# Altium schematic sheet ModuleInter.SchDoc
size 431 x 279 mm; SheetNumber: 1; SheetTotal: 2
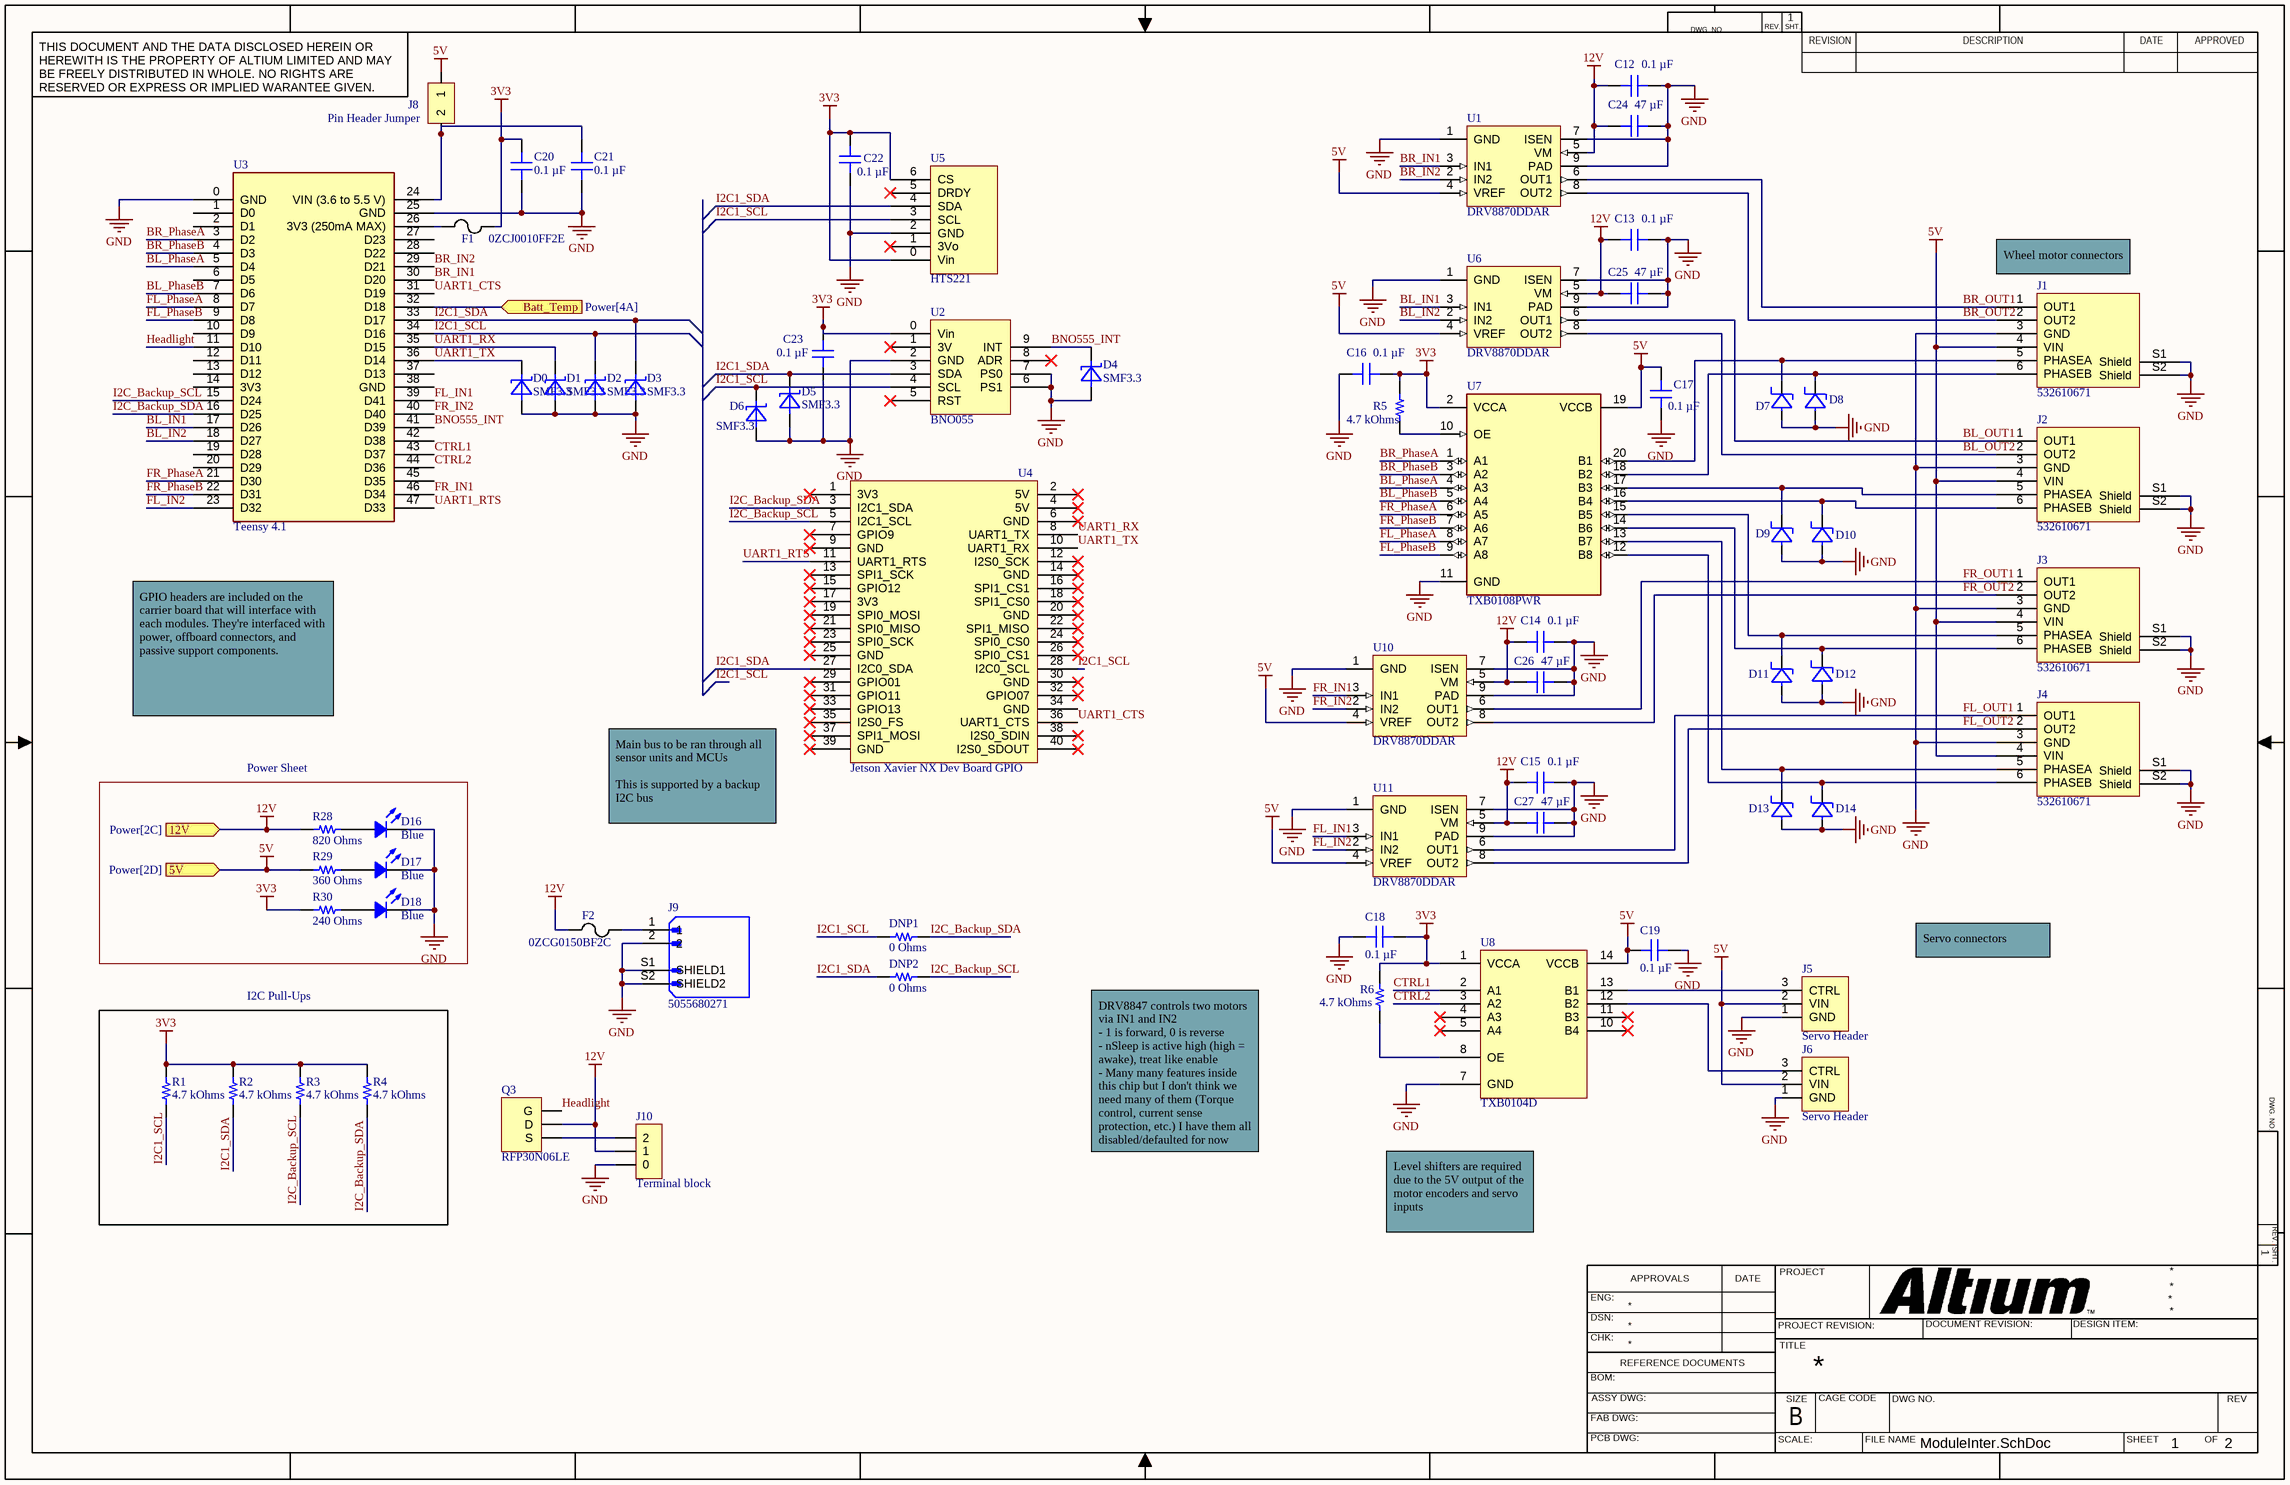
[diagram p0: ModuleInter.SchDoc]

## Parts
C12  0.1 µF  [CAP 1206_3216 - 0.8MM]
C13  0.1 µF  [CAP 1206_3216 - 0.8MM]
C14  0.1 µF  [CAP 1206_3216 - 0.8MM]
C15  0.1 µF  [CAP 1206_3216 - 0.8MM]
C16  0.1 µF  [CAP 1206_3216 - 0.8MM]
C17  0.1 µF  [CAP 1206_3216 - 0.8MM]
C18  0.1 µF  [CAP 1206_3216 - 0.8MM]
C19  0.1 µF  [CAP 1206_3216 - 0.8MM]
C20  0.1 µF  [CAP 1206_3216 - 0.8MM]
C21  0.1 µF  [CAP 1206_3216 - 0.8MM]
C22  0.1 µF  [CAP 1206_3216 - 0.8MM]
C23  0.1 µF  [CAP 1206_3216 - 0.8MM]
C24  47 µF  [CAP 1206_3216 - 0.8MM]
C25  47 µF  [CAP 1206_3216 - 0.8MM]
C26  47 µF  [CAP 1206_3216 - 0.8MM]
C27  47 µF  [CAP 1206_3216 - 0.8MM]
D0  SMF3.3  [SODFL3718X108N]
D1  SMF3.3  [SODFL3718X108N]
D2  SMF3.3  [SODFL3718X108N]
D3  SMF3.3  [SODFL3718X108N]
D4  SMF3.3  [SODFL3718X108N]
D5  SMF3.3  [SODFL3718X108N]
D6  SMF3.3  [SODFL3718X108N]
D7  SMBJ5.0CA-13-F  [SMB_DIO]  (value not drawn)
D8  SMBJ5.0CA-13-F  [SMB_DIO]  (value not drawn)
D9  SMBJ5.0CA-13-F  [SMB_DIO]  (value not drawn)
D10  SMBJ5.0CA-13-F  [SMB_DIO]  (value not drawn)
D11  SMBJ5.0CA-13-F  [SMB_DIO]  (value not drawn)
D12  SMBJ5.0CA-13-F  [SMB_DIO]  (value not drawn)
D13  SMBJ5.0CA-13-F  [SMB_DIO]  (value not drawn)
D14  SMBJ5.0CA-13-F  [SMB_DIO]  (value not drawn)
D16  Blue  [LED 1206_3216 BLUE]
D17  Blue  [LED 1206_3216 BLUE]
D18  Blue  [LED 1206_3216 BLUE]
DNP1  0 Ohms  [RES 1206_3216]
DNP2  0 Ohms  [RES 1206_3216]
F1  0ZCJ0010FF2E  [RESC3216X125N]
F2  0ZCG0150BF2C  [0ZCG_BEL]
J1  532610671  [MOLEX_532610671]
J2  532610671  [MOLEX_532610671]
J3  532610671  [MOLEX_532610671]
J4  532610671  [MOLEX_532610671]
J5  Servo Header  [Servo Header]
J6  Servo Header  [Servo Header]
J8  Pin Header Jumper  [Pin Header Jumper]
J9  5055680271  [MOLEX_5055680271]
J10  Terminal block  [Terminal Holes]
Q3  RFP30N06LE  [PWM Fet]
R1  4.7 kOhms  [RES 1206_3216]
R2  4.7 kOhms  [RES 1206_3216]
R3  4.7 kOhms  [RES 1206_3216]
R4  4.7 kOhms  [RES 1206_3216]
R5  4.7 kOhms  [RES 1206_3216]
R6  4.7 kOhms  [RES 1206_3216]
R28  820 Ohms  [RES 1206_3216]
R29  360 Ohms  [RES 1206_3216]
R30  240 Ohms  [RES 1206_3216]
U1  DRV8870DDAR  [VREG_LM5017MR/NOPB]
U2  BNO055  [BNO555 - Header Mode]
U3  Teensy 4.1  [Teensy 4.1]
U4  Jetson Xavier NX Dev Board GPIO  [Xavier Interface]
U5  HTS221  [HTS221]
U6  DRV8870DDAR  [VREG_LM5017MR/NOPB]
U7  TXB0108PWR  [SOP65P640X120-20N]
U8  TXB0104D  [TI SOIC-14 D]
U10  DRV8870DDAR  [VREG_LM5017MR/NOPB]
U11  DRV8870DDAR  [VREG_LM5017MR/NOPB]

## Blocks framed on the sheet
Power Sheet: D16-D18 R28-R30
I2C Pull-Ups: R1-R4

## Ports
5V (in, see Power[2D]), 12V (in, see Power[2C]), Batt_Temp (in, see Power[4A])

## Nets
3V3: C16.1 C18.1 C20.1 C22.1 C23.1 F1.2 R1.2 R2.2 R3.2 R4.2 R5.1 R6.2 R30.1 U2.0(Vin) U5.0(Vin) U5.6(CS) U7.2(VCCA) U8.1(VCCA)
5V: C17.1 C19.1 J1.4(VIN) J2.4(VIN) J3.4(VIN) J4.4(VIN) J5.2(VIN) J6.2(VIN) J8.1 R29.1 U1.4(VREF) U6.4(VREF) U7.19(VCCB) U8.14(VCCB) U10.4(VREF) U11.4(VREF) ; port 5V
12V: C12.2 C13.2 C14.2 C15.2 C24.1 C25.1 C26.1 C27.1 F2.1 J10.1 Q3.1(D) R28.1 U1.5(VM) U6.5(VM) U10.5(VM) U11.5(VM) ; port 12V
GND: C12.1 C13.1 C14.1 C15.1 C16.2 C17.2 C18.2 C19.2 C20.2 C21.2 C22.2 C23.2 C24.2 C25.2 C26.2 C27.2 D0.C(A) D1.C(A) D2.C(A) D3.C(A) D4.C(A) D5.C(A) D6.C(A) D7.2 D8.2 D9.2 D10.2 D11.2 D12.2 D13.2 D14.2 D16.2 D17.2 D18.2 J1.3(GND) J1.S1(Shield) J1.S2(Shield) J2.3(GND) J2.S1(Shield) J2.S2(Shield) J3.3(GND) J3.S1(Shield) J3.S2(Shield) J4.3(GND) J4.S1(Shield) J4.S2(Shield) J5.1(GND) J6.1(GND) J9.2 J9.S1(SHIELD1) J9.S2(SHIELD2) J10.0 U1.1(GND) U1.7(ISEN) U1.9(PAD) U2.2(GND) U2.6(PS1) U2.7(PS0) U3.0(GND) U3.25(GND) U5.2(GND) U6.1(GND) U6.7(ISEN) U6.9(PAD) U7.11(GND) U8.7(GND) U10.1(GND) U10.7(ISEN) U10.9(PAD) U11.1(GND) U11.7(ISEN) U11.9(PAD)
Batt_Temp: U3.32(D18) ; port Batt_Temp
BL_IN1: U3.17(D26) U6.3(IN1)
BL_IN2: U3.18(D27) U6.2(IN2)
BL_OUT1: J2.1(OUT1) U6.6(OUT1)
BL_OUT2: J2.2(OUT2) U6.8(OUT2)
BL_PhaseA: U3.5(D4) U7.4(A3)
BL_PhaseB: U3.7(D6) U7.5(A4)
BNO555_INT: D4.A(C) U2.9(INT) U3.41(D39)
BR_IN1: U1.3(IN1) U3.30(D20)
BR_IN2: U1.2(IN2) U3.29(D21)
BR_OUT1: J1.1(OUT1) U1.6(OUT1)
BR_OUT2: J1.2(OUT2) U1.8(OUT2)
BR_PhaseA: U3.3(D2) U7.1(A1)
BR_PhaseB: U3.4(D3) U7.3(A2)
CTRL1: U3.43(D37) U8.2(A1)
CTRL2: U3.44(D36) U8.3(A2)
FL_IN1: U3.39(D41) U11.3(IN1)
FL_IN2: U3.23(D32) U11.2(IN2)
FL_OUT1: J4.1(OUT1) U11.6(OUT1)
FL_OUT2: J4.2(OUT2) U11.8(OUT2)
FL_PhaseA: U3.8(D7) U7.8(A7)
FL_PhaseB: U3.9(D8) U7.9(A8)
FR_IN1: U3.46(D34) U10.3(IN1)
FR_IN2: U3.40(D40) U10.2(IN2)
FR_OUT1: J3.1(OUT1) U10.6(OUT1)
FR_OUT2: J3.2(OUT2) U10.8(OUT2)
FR_PhaseA: U3.21(D30) U7.6(A5)
FR_PhaseB: U3.22(D31) U7.7(A6)
Headlight: Q3.0(G) U3.11(D10)
I2C1_SCL: D2.A(C) D6.A(C) DNP1.1 R1.1 U2.4(SCL) U3.34(D16) U4.28(I2C0_SCL) U5.3(SCL)
I2C1_SDA: D3.A(C) D5.A(C) DNP2.1 R2.1 U2.3(SDA) U3.33(D17) U4.27(I2C0_SDA) U5.4(SDA)
I2C_Backup_SCL: DNP2.2 R3.1 U3.15(D24) U4.5(I2C1_SCL)
I2C_Backup_SDA: DNP1.2 R4.1 U3.16(D25) U4.3(I2C1_SDA)
UART1_CTS: U3.31(D19) U4.36(UART1_CTS)
UART1_RTS: U3.47(D33) U4.11(UART1_RTS)
UART1_RX: D1.A(C) U3.35(D15) U4.8(UART1_TX)
UART1_TX: D0.A(C) U3.36(D14) U4.10(UART1_RX)
NetC21_1: C21.1 J8.2 U3.24(VIN_(3.6_to_5.5_V))
NetD7_1: D7.1 J1.5(PHASEA) U7.20(B1)
NetD8_1: D8.1 J1.6(PHASEB) U7.18(B2)
NetD9_1: D9.1 J2.5(PHASEA) U7.17(B3)
NetD10_1: D10.1 J2.6(PHASEB) U7.16(B4)
NetD11_1: D11.1 J3.5(PHASEA) U7.15(B5)
NetD12_1: D12.1 J3.6(PHASEB) U7.14(B6)
NetD13_1: D13.1 J4.5(PHASEA) U7.13(B7)
NetD14_1: D14.1 J4.6(PHASEB) U7.12(B8)
NetD16_1: D16.1 R28.2
NetD17_1: D17.1 R29.2
NetD18_1: D18.1 R30.2
NetF1_1: F1.1 U3.26(3V3_(250mA_MAX))
NetF2_2: F2.2 J9.1
NetJ5_3: J5.3(CTRL) U8.13(B1)
NetJ6_3: J6.3(CTRL) U8.12(B2)
NetJ10_2: J10.2 Q3.2(S)
NetR5_2: R5.2 U7.10(OE)
NetR6_1: R6.1 U8.8(OE)

Not connected (* = marked no-connect by the designer): U2 1(3V)* 5(RST)* 8(ADR)*; U3 1(D0) 2(D1) 6(D5) 10(D9) 12(D11) 13(D12) 14(3V3) 19(D28) 20(D29) 27(D23) 28(D22) 37(D13) 38(GND) 42(D38) 45(D35); U4 1(3V3)* 2(5V)* 4(5V)* 6(GND)* 7(GPIO9)* 9(GND)* 12(I2S0_SCK)* 13(SPI1_SCK)* 14(GND)* 15(GPIO12)* 16(SPI1_CS1)* 17(3V3)* 18(SPI1_CS0)* 19(SPI0_MOSI)* 20(GND)* 21(SPI0_MISO)* 22(SPI1_MISO)* 23(SPI0_SCK)* 24(SPI0_CS0)* 25(GND)* 26(SPI0_CS1)* 29(GPIO01)* 30(GND)* 31(GPIO11)* 32(GPIO07)* 33(GPIO13)* 34(GND) 35(I2S0_FS)* 37(SPI1_MOSI)* 38(I2S0_SDIN)* 39(GND)* 40(I2S0_SDOUT)*; U5 1(3Vo)* 5(DRDY)*; U8 4(A3)* 5(A4)* 10(B4)* 11(B3)*

## Notes on the sheet
- (near J1) Wheel motor connectors
- GPIO headers are included on the carrier board that will interface with each modules. They're interfaced with power, offboard connectors, and passive support components.
- Main bus to be ran through all sensor units and MCUs
  This is supported by a backup I2C bus
- Servo connectors
- DRV8847 controls two motors via IN1 and IN2
  - 1 is forward, 0 is reverse
  - nSleep is active high (high = awake), treat like enable
  - Many many features inside this chip but I don't think we need many of them (Torque control, current sense protection, etc.) I have them all disabled/defaulted for now
- Level shifters are required due to the 5V output of the motor encoders and servo inputs
- DWG. NO.
- REV.
- SHT.
- THIS DOCUMENT AND THE DATA DISCLOSED HEREIN OR HEREWITH IS THE PROPERTY OF ALTIUM LIMITED AND MAY BE FREELY DISTRIBUTED IN WHOLE. NO RIGHTS ARE RESERVED OR EXPRESS OR IMPLIED WARANTEE GIVEN.
- REVISION
- DESCRIPTION
- DATE
- APPROVED
- ENG:
- APPROVALS
- PROJECT
- DSN:
- CHK:
- REFERENCE DOCUMENTS
- PROJECT REVISION:
- TITLE
- DOCUMENT REVISION:
- DESIGN ITEM:
- BOM:
- FAB DWG:
- PCB DWG:
- ASSY DWG:
- SCALE:
- SIZE
- B
- CAGE CODE
- FILE NAME
- DWG NO.
- SHEET
- OF
- REV

## Library data of the parts
C12-C23 = CC1206MRY5V9BB104: CAP CER 0.1UF 50V Y5V 1206; manufacturer: Yageo; Temperature Coefficient: Y5V (F); Tolerance: ±20%; Part Number: CC1206MRY5V9BB104; Value: 0.1 µF; Applications: General Purpose; Capacitance: 0.1 µF; componentlink1description: Datasheet; componentlink1url: http://www.yageo.com/documents/recent/UPY-GPHC_Y5V_6.3V-to-50V_8.pdf; componentlink2description: DigiKey Link; componentlink2url: https://www.digikey.com/en/products/detail/yageo/CC1206MRY5V9BB104/5884674; Device Package: 1206 (3216 Metric); lastupdated: 3/20/2023 7:15:05 PM; Lifecycle Status: Active; Minimum Order: 1; Mounting Type: Surface Mount, MLCC; Operating Temperature: -30°C ~ 85°C; Package / Case: 1206 (3216 Metric); packaging: TapeAndReel; partid: 18711; Part Status: Active; price: 0.05; series: CC; Size / Dimension: 0.126" L x 0.063" W (3.20mm x 1.60mm); Supplier 1: DigiKey; Supplier Part Number 1: 311-4504-1-ND; Thickness (Max): 0.028" (0.70mm); Voltage - Rated: 50V
C24-C27 = JMK316ABJ476MD-T: CAP CER 47UF 6.3V X5R 1206; manufacturer: Taiyo Yuden; Tolerance: ±20%; Part Number: JMK316ABJ476MD-T; Value: 47 µF; Applications: SMPS Filtering; Capacitance: 47 µF; componentlink1description: Datasheet; componentlink1url: https://www.yuden.co.jp/productdata/catalog/mlcc01_e.pdf; componentlink2description: DigiKey Link; componentlink2url: https://www.digikey.com/en/products/detail/taiyo-yuden/JMK316ABJ476MD-T/4970735; Device Package: 1206 (3216 Metric); lastupdated: 3/20/2023 7:14:47 PM; Lifecycle Status: Active; Minimum Order: 1; Mounting Type: Surface Mount, MLCC; Operating Temperature: -55°C ~ 85°C; Package / Case: 1206 (3216 Metric); packaging: TapeAndReel; partid: 20554; Part Status: Active; price: 0.31; series: M; Size / Dimension: 0.126" L x 0.063" W (3.20mm x 1.60mm); Supplier 1: DigiKey; Supplier Part Number 1: 587-6329-1-ND; Temperature Coefficient: X5R; Thickness (Max): 0.037" (0.95mm); Voltage - Rated: 6.3V
D0-D6 = SMF3.3: 6.8V Clamp 30A Ipp Tvs Diode Surface Mount SOD-123FL; MF: Littelfuse Inc.; Digi-Key_Purchase_URL: https://www.digikey.ca/product-detail/en/littelfuse-inc/SMF3.3/F7701CT-ND/6189041?utm_source=snapeda&utm_medium=aggregator&utm_campaign=symbol; SnapEDA_Link: https://www.snapeda.com/parts/SMF3.3/Littelfuse%20Inc./view-part/814507/?ref=snap; MP: SMF3.3; Value: *; Digi-Key_Part_Number: F7701CT-ND; Package: SOD-123 Littelfuse
D7-D14 = SMBJ5.0CA-13-F: DIODE ZENER 6.2V 600W
D16-D18 = LTST-C150TBKT: LED BLUE CLEAR 1206 SMD; Manufacturer: Lite-On Inc.; Configuration: Standard; Current - Test: 20mA; Lens Color: Colorless; Lens Size: 2.06mm x 1.60mm; Lens Style: Rectangle with Flat Top; Millicandela Rating: 104mcd; Viewing Angle: 130°; Voltage - Forward (Vf) (Typ): 3.3V; Wavelength - Dominant: 470nm; Wavelength - Peak: 468nm; Part Number: LTST-C150TBKT; Color: Blue; ComponentLink1Description: Datasheet; ComponentLink1URL: http://optoelectronics.liteon.com/upload/download/DS22-2000-026/LTST-C150TBKT(0630).pdf; ComponentLink2Description: DigiKey Link; ComponentLink2URL: http://digikey.com/product-detail/en/lite-on-inc/LTST-C150TBKT/160-1643-1-ND/573584; Device Package: 1206 (3216 Metric); Height (Max): 1.10mm; LastUpdated: 3/20/2023 7:58:08 PM; Lens Transparency: Clear; Lifecycle Status: Active; Minimum Order: 1; Mounting Type: Surface Mount; Package / Case: 1206 (3216 Metric); Packaging: TapeAndReel; PartId: 744; Part Status: Active; Price: 0.08; Series: -; Size / Dimension: 3.20mm L x 1.60mm W; Supplier 1: DigiKey; Supplier Part Number 1: 160-1643-1-ND; Supplier Device Package: 1206; Value: Blue
DNP1 DNP2 = RC1206JR-7W0RL: RES 0 OHM JUMPER 1/2W 1206; Manufacturer: Yageo; Power (Watts): 0.5W, 1/2W; Part Number: RC1206JR-7W0RL; ComponentLink1Description: Datasheet; ComponentLink1URL: https://www.yageo.com/upload/media/product/productsearch/datasheet/rchip/PYu-RC_Group_51_RoHS_L_11.pdf; ComponentLink2Description: DigiKey Link; ComponentLink2URL: https://www.digikey.com/en/products/detail/yageo/RC1206JR-7W0RL/12698846; Composition: Thick Film; Device Package: 1206 (3216 Metric); Features: Moisture Resistant; Height - Seated (Max): 0.026" (0.65mm); LastUpdated: 3/20/2023 7:35:33 PM; Lifecycle Status: Active; Minimum Order: 1; Number of Terminations: 2; Operating Temperature: -55°C ~ 155°C; Package / Case: 1206 (3216 Metric); Packaging: TapeAndReel; PartId: 66997; Part Status: Active; Price: 0.01; Resistance: 0 Ohms; Series: RC_L; Size / Dimension: 0.122" L x 0.063" W (3.10mm x 1.60mm); Supplier 1: DigiKey; Supplier Part Number 1: 13-RC1206JR-7W0RLCT-ND; Supplier Device Package: 1206; Tolerance: Jumper; Value: 0 Ohms
F1 = 0ZCJ0010FF2E: Polymeric PTC Resettable Fuse 60V 100 mA Ih Surface Mount 1206 (3216 Metric), Concave; MF: Bel Fuse; MP: 0ZCJ0010FF2E; SnapEDA_Link: https://www.snapeda.com/parts/0ZCJ0010FF2E/Bel%20Fuse%20Inc./view-part/1315579/?ref=snap; Price: None; Package: 1206 Bel Fuse; Availability: Unavailable; Value: *
F2 = 0ZCG0150BF2C: Polymeric PTC Resettable Fuse 24V 1.5 A Ih Surface Mount 1812 (4532 Metric), Concave; Mfr_Name: Belfuse; Type: DEV; Copyright: Copyright (C) 2023 Ultra Librarian. All rights reserved.; Manufacturer_Part_Number: 0ZCG0150BF2C; Digi-Key_Part_Number_1: 507-1773-1-ND; Digi-Key_Part_Number_2: 507-1773-2-ND; Digi-Key_Part_Number_3: 507-1773-6-ND; RefDes: RefDes
J1-J4 = 532610671: Conn Shrouded Header (4 Sides) HDR 6 POS 1.25mm Solder RA Side Entry SMD PicoBlade™ T/R
J5 J6 = Servo Header: 3P jumper header
J9 = 5055680271: 1.25mm Pitch, Micro-Lock Plus PCB Header, Single Row, Vertical, Surface Mount, Tin-Bismuth Plating, Positive Lock, 2 Circuits, with Pick-and-Place Polyimide Tape, Black; MF: Molex; Availability: In Stock; Price: None; Purchase-URL: https://pricing.snapeda.com/search/part/5055680271/?ref=eda; Package: None; SnapEDA_Link: https://www.snapeda.com/parts/5055680271/Molex/view-part/?ref=snap; MP: 5055680271; Value: *; Check_prices: https://www.snapeda.com/parts/5055680271/Molex/view-part/?ref=eda
Q3 = RFP30N06LE: Standin fro PWM mosfet for Light bar
R1-R6 = CRG1206F4K7: RES SMD 4.7K OHM 1% 1/4W 1206; Manufacturer: TE Connectivity Passive Product; Power (Watts): 0.25W, 1/4W; Temperature Coefficient: ±100ppm/°C; Part Number: CRG1206F4K7; ComponentLink1Description: Datasheet; ComponentLink1URL: https://www.te.com/commerce/DocumentDelivery/DDEController?Action=srchrtrv&DocNm=1773204&DocType=DS&DocLang=English; ComponentLink2Description: DigiKey Link; ComponentLink2URL: https://www.digikey.com/en/products/detail/te-connectivity-passive-product/CRG1206F4K7/2381014; Composition: Thick Film; Device Package: 1206 (3216 Metric); Height - Seated (Max): 0.026" (0.65mm); LastUpdated: 3/20/2023 7:37:21 PM; Lifecycle Status: Active; Minimum Order: 1; Number of Terminations: 2; Operating Temperature: -55°C ~ 155°C; Package / Case: 1206 (3216 Metric); Packaging: TapeAndReel; PartId: 26987; Part Status: Active; Price: 0.01; Resistance: 4.7 kOhms; Series: CRG, Neohm; Size / Dimension: 0.122" L x 0.061" W (3.10mm x 1.55mm); Supplier 1: DigiKey; Supplier Part Number 1: A106078CT-ND; Supplier Device Package: 1206; Tolerance: ±1%; Value: 4.7 kOhms
R28 = CRGCQ1206F820R: RES 820 OHM 1% 1/4W 1206; Manufacturer: TE Connectivity Passive Product; Power (Watts): 0.25W, 1/4W; Temperature Coefficient: ±100ppm/°C; Part Number: CRGCQ1206F820R; ComponentLink1Description: Datasheet; ComponentLink1URL: https://www.te.com/commerce/DocumentDelivery/DDEController?Action=srchrtrv&DocNm=1773204-3&DocType=DS&DocLang=English; ComponentLink2Description: DigiKey Link; ComponentLink2URL: https://www.digikey.com/en/products/detail/te-connectivity-passive-product/CRGCQ1206F820R/8576411; Composition: Thick Film; Device Package: 1206 (3216 Metric); Features: Automotive AEC-Q200, Moisture Resistant; Height - Seated (Max): 0.026" (0.65mm); LastUpdated: 3/20/2023 7:37:21 PM; Lifecycle Status: Active; Minimum Order: 1; Number of Terminations: 2; Operating Temperature: -55°C ~ 155°C; Package / Case: 1206 (3216 Metric); Packaging: TapeAndReel; PartId: 26992; Part Status: Active; Price: 0.01; Ratings: AEC-Q200; Resistance: 820 Ohms; Series: CRGCQ; Size / Dimension: 0.122" L x 0.061" W (3.10mm x 1.55mm); Supplier 1: DigiKey; Supplier Part Number 1: A129809CT-ND; Supplier Device Package: 1206; Tolerance: ±1%; Value: 820 Ohms
R29 = RMCF1206FT360R: RES 360 OHM 1% 1/4W 1206; Manufacturer: Stackpole Electronics Inc; Power (Watts): 0.25W, 1/4W; Temperature Coefficient: ±100ppm/°C; Part Number: RMCF1206FT360R; ComponentLink1Description: Datasheet; ComponentLink1URL: https://www.seielect.com/catalog/sei-rmcf_rmcp.pdf; ComponentLink2Description: DigiKey Link; ComponentLink2URL: https://www.digikey.com/en/products/detail/stackpole-electronics-inc/RMCF1206FT360R/1759905; Composition: Thick Film; Device Package: 1206 (3216 Metric); Features: Automotive AEC-Q200; Height - Seated (Max): 0.028" (0.70mm); LastUpdated: 3/20/2023 7:36:13 PM; Lifecycle Status: Active; Minimum Order: 1; Number of Terminations: 2; Operating Temperature: -55°C ~ 155°C; Package / Case: 1206 (3216 Metric); Packaging: CutTape; PartId: 41716; Part Status: Active; Price: 0.01; Ratings: AEC-Q200; Resistance: 360 Ohms; Series: RMCF; Size / Dimension: 0.126" L x 0.063" W (3.20mm x 1.60mm); Supplier 1: DigiKey; Supplier Part Number 1: RMCF1206FT360RCT-ND; Supplier Device Package: 1206; Tolerance: ±1%; Value: 360 Ohms
R30 = RCS1206240RFKEA: RCS1206 100 240R 1% ET1 E3; Manufacturer: Vishay Dale; Power (Watts): 0.5W, 1/2W; Temperature Coefficient: ±100ppm/°C; Part Number: RCS1206240RFKEA; ComponentLink1Description: Datasheet; ComponentLink1URL: https://www.vishay.com/docs/20065/rcse3.pdf; ComponentLink2Description: DigiKey Link; ComponentLink2URL: https://www.digikey.com/en/products/detail/vishay-dale/RCS1206240RFKEA/12446277; Composition: Thick Film; Device Package: 1206 (3216 Metric); Features: Automotive AEC-Q200, Pulse Withstanding; Height - Seated (Max): 0.026" (0.65mm); LastUpdated: 3/20/2023 7:35:45 PM; Lifecycle Status: Active; Minimum Order: 1; Number of Terminations: 2; Operating Temperature: -55°C ~ 155°C; Package / Case: 1206 (3216 Metric); Packaging: TapeAndReel; PartId: 58743; Part Status: Active; Price: 0.04; Ratings: AEC-Q200; Resistance: 240 Ohms; Series: RCS e3; Size / Dimension: 0.126" L x 0.063" W (3.20mm x 1.60mm); Supplier 1: DigiKey; Supplier Part Number 1: 541-RCS1206240RFKEACT-ND; Supplier Device Package: 1206; Tolerance: ±1%; Value: 240 Ohms
U1 U6 U10 U11 = DRV8870DDAR: 45-V, 3.6-A H-bridge motor driver with current regulation 8-SO PowerPAD -40 to 125; MF: Texas Instruments; MP: DRV8870DDAR; Package: HSOIC-8 Texas Instruments; Purchase-URL: https://pricing.snapeda.com/search/part/DRV8870DDAR/?ref=eda; Digi-Key_Part_Number: 296-42660-1-ND; SnapEDA_Link: https://www.snapeda.com/parts/DRV8870DDAR/Texas%20Instruments/view-part/591151/?ref=snap; Value: *
U3 = Teensy 4.1: This is a 1-1 model of the Teensy 4.1, each pin number represents the order in which they appear on the board. / ********The pins are labelled differently according their digital pin number so keep that in mind when referencing.
U4 = Jetson Xavier NX Dev Board GPIO: Just the GPIO expansion header for the Jetson Xavier NX Dev Board, this is so there is a contact point on the board placed next to the mount of the board to interface with other compenents
U7 = TXB0108PWR: 8-Bit Bidirectional Voltage-Level Shifter with Auto Direction Sensing and +/-15-kV ESD Protect; MF: Texas Instruments; SnapEDA_Link: https://www.snapeda.com/parts/TXB0108PWR/Texas+Instruments/view-part/?ref=snap; Package: TSSOP-20 Texas Instruments; MP: TXB0108PWR; Check_prices: https://www.snapeda.com/parts/TXB0108PWR/Texas+Instruments/view-part/?ref=eda; Purchase-URL: https://pricing.snapeda.com/search/part/TXB0108PWR/?ref=eda; Digi-Key_Part_Number: 296-21527-2-ND; Value: *
U8 = TXB0104D: IC TRNSLTR BIDIRECTIONAL 14SOIC; Manufacturer: Texas Instruments; Channels per Circuit: 4; Data Rate: 100Mbps; Number of Circuits: 1; Output Type: Tri-State, Non-Inverted; Translator Type: Voltage Level; Voltage - VCCA: 1.2V ~ 3.6V; Voltage - VCCB: 1.65V ~ 5.5V; Part Number: TXB0104D; Channel Type: Bidirectional; ComponentLink1Description: Datasheet; ComponentLink1URL: http://www.ti.com/general/docs/suppproductinfo.tsp?distId=10&gotoUrl=http%3A%2F%2Fwww.ti.com%2Flit%2Fgpn%2Ftxb0104; ComponentLink2Description: DigiKey Link; ComponentLink2URL: http://digikey.com/product-detail/en/texas-instruments/TXB0104D/296-34698-5-ND/1910151; Device Package: 14-SOIC (0.154", 3.90mm Width); Features: Auto-Direction Sensing; LastUpdated: 5/13/2020 5:09:43 PM; Lifecycle Status: Active; Minimum Order: 1; Mounting Type: Surface Mount; Operating Temperature: -40°C ~ 85°C (TA); Package / Case: 14-SOIC (0.154", 3.90mm Width); Packaging: Tube; Part Status: Active; Price: 1.53; Series: -; Supplier 1: DigiKey; Supplier Part Number 1: 296-34698-5-ND; Supplier Device Package: 14-SOIC